# Altium schematic sheet Schematic_LED_SHIELD_DIGITAL.SchDoc: Digital Electronics
size B; Author: Artem Dementyev; DrawnBy: Artem Dementyev; Engineer: Artem Dementyev; Revision: 1
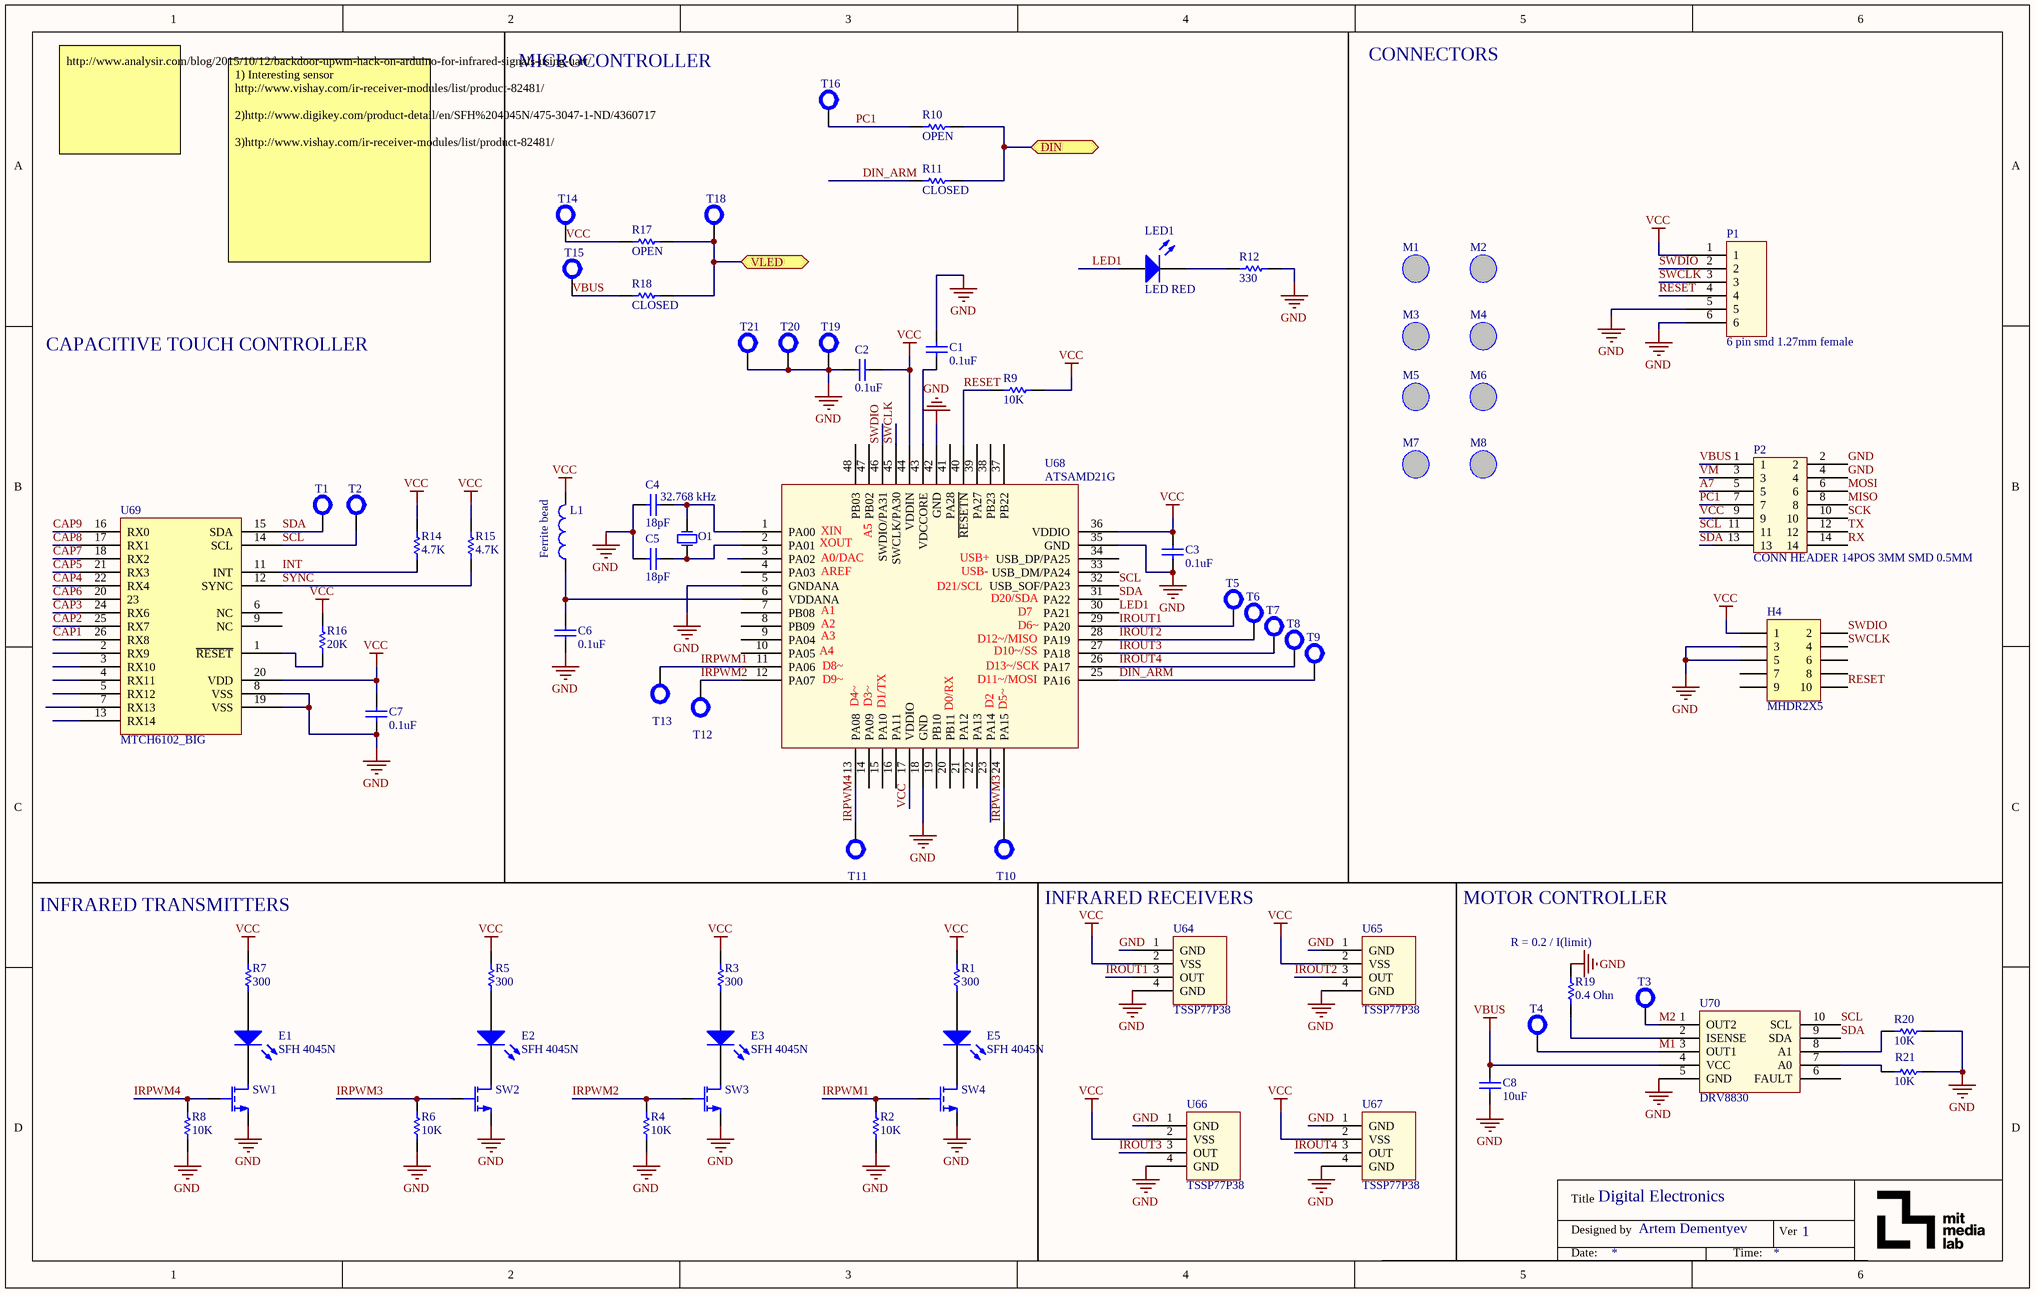
[diagram p0: Schematic_LED_SHIELD_DIGITAL.SchDoc]

## Parts
C1  0.1uF  [0603W]
C2  0.1uF  [0603W]
C3  0.1uF  [0603W]
C4  18pF  [0603W]
C5  18pF  [0603W]
C6  0.1uF  [0603W]
C7  0.1uF  [0603W]
C8  10uF  [0603W]
E1  SFH 4045N  [SFH 4045N]
E2  SFH 4045N  [SFH 4045N]
E3  SFH 4045N  [SFH 4045N]
E5  SFH 4045N  [SFH 4045N]
H4  MHDR2X5  [MHDR2X5]
L1  Ferrite bead  [0603W]
LED1  LED RED  [0603W]
M1  Custom_magnet_holder  [3mm_magnet_holder]  (value not drawn)
M2  Custom_magnet_holder  [3mm_magnet_holder]  (value not drawn)
M3  Custom_magnet_holder  [3mm_magnet_holder]  (value not drawn)
M4  Custom_magnet_holder  [3mm_magnet_holder]  (value not drawn)
M5  Custom_magnet_holder  [3mm_magnet_holder]  (value not drawn)
M6  Custom_magnet_holder  [3mm_magnet_holder]  (value not drawn)
M7  Custom_magnet_holder  [3mm_magnet_holder]  (value not drawn)
M8  Custom_magnet_holder  [3mm_magnet_holder]  (value not drawn)
O1  32.768 kHz  [32.768 Crystal]
P1  6 pin smd 1.27mm female  [6pos 1.27mm]
P2  CONN HEADER 14POS 3MM SMD 0.5MM  [DF12 14Pos Female]
R1  300  [0603W]
R2  10K  [0603W]
R3  300  [0603W]
R4  10K  [0603W]
R5  300  [0603W]
R6  10K  [0603W]
R7  300  [0603W]
R8  10K  [0603W]
R9  10K  [0603W]
R10  OPEN  [0603W]
R11  CLOSED  [0603W]
R12  330  [0603W]
R14  4.7K  [0603W]
R15  4.7K  [0603W]
R16  20K  [0603W]
R17  OPEN  [0603W]
R18  CLOSED  [0603W]
R19  0.4 Ohn  [0603W]
R20  10K  [0603W]
R21  10K  [0603W]
SW1  MOSFET N CHANNEL  [SOT323]  (value not drawn)
SW2  MOSFET N CHANNEL  [SOT323]  (value not drawn)
SW3  MOSFET N CHANNEL  [SOT323]  (value not drawn)
SW4  MOSFET N CHANNEL  [SOT323]  (value not drawn)
T1  Test point small  [TEST POINT SMD SUPER SMALL]  (value not drawn)
T2  Test point small  [TEST POINT SMD SUPER SMALL]  (value not drawn)
T3  Test point small  [TEST POINT SMD SUPER SMALL]  (value not drawn)
T4  Test point small  [TEST POINT SMD SUPER SMALL]  (value not drawn)
T5  Test point small  [TEST POINT SMD SUPER SMALL]  (value not drawn)
T6  Test point small  [TEST POINT SMD SUPER SMALL]  (value not drawn)
T7  Test point small  [TEST POINT SMD SUPER SMALL]  (value not drawn)
T8  Test point small  [TEST POINT SMD SUPER SMALL]  (value not drawn)
T9  Test point small  [TEST POINT SMD SUPER SMALL]  (value not drawn)
T10  Test point small  [TEST POINT SMD SUPER SMALL]  (value not drawn)
T11  Test point small  [TEST POINT SMD SUPER SMALL]  (value not drawn)
T12  Test point small  [TEST POINT SMD SUPER SMALL]  (value not drawn)
T13  Test point small  [TEST POINT SMD SUPER SMALL]  (value not drawn)
T14  Test point small  [TEST POINT SMD SUPER SMALL]  (value not drawn)
T15  Test point small  [TEST POINT SMD SUPER SMALL]  (value not drawn)
T16  Test point small  [TEST POINT SMD SUPER SMALL]  (value not drawn)
T18  Test point small  [TEST POINT SMD SUPER SMALL]  (value not drawn)
T19  Test point small  [TEST POINT SMD SUPER SMALL]  (value not drawn)
T20  Test point small  [TEST POINT SMD SUPER SMALL]  (value not drawn)
T21  Test point small  [TEST POINT SMD SUPER SMALL]  (value not drawn)
U64  TSSP77P38  [TSSP77P38]
U65  TSSP77P38  [TSSP77P38]
U66  TSSP77P38  [TSSP77P38]
U67  TSSP77P38  [TSSP77P38]
U68  ATSAMD21G  [TQFN48]
U69  MTCH6102_BIG  [SS28]
U70  DRV8830  [MSOP10_TI_POWERPAD]

## Ports
DIN, VLED

## Nets
GND: C1.2 C2.2 C3.1 C4.2 C5.2 C6.1 C7.1 C8.1 H4.3 H4.5 P1.5 P1.6 P2.2 P2.4 R2.2 R4.2 R6.2 R8.2 R12.1 R19.1 R20.2 R21.2 SW1.2(S) SW2.2(S) SW3.2(S) SW4.2(S) T19.0 T20.0 T21.0 U64.1(GND) U64.4(GND) U65.1(GND) U65.4(GND) U66.1(GND) U66.4(GND) U67.1(GND) U67.4(GND) U68.5(GNDANA) U68.18(GND) U68.35(GND) U68.42(GND) U69.8(VSS) U69.19(VSS) U70.5(GND)
VBUS: C8.2 P2.1 R18.2 T15.0 U70.4(VCC)
VCC: C2.1 C3.2 C7.2 H4.1 L1.2 P1.1 P2.9 R1.1 R3.1 R5.1 R7.1 R9.1 R14.2 R15.2 R16.1 R17.2 T14.0 U64.2(VSS) U65.2(VSS) U66.2(VSS) U67.2(VSS) U68.17(VDDIO) U68.36(VDDIO) U68.44(VDDIN) U69.20(VDD)
A7: P2.5
CAP1: U69.26(RX8)
CAP2: U69.25(RX7)
CAP3: U69.24(RX6)
CAP4: U69.22(RX4)
CAP5: U69.21(RX3)
CAP6: U69.20(23)
CAP7: U69.18(RX2)
CAP8: U69.17(RX1)
CAP9: U69.16(RX0)
DIN: R10.1 R11.1 ; port DIN
DIN_ARM: R11.2 T9.0 U68.25(PA16)
INT: R14.1 U69.11(INT)
IROUT1: T5.0 U64.3(OUT) U68.29(PA20)
IROUT2: T6.0 U65.3(OUT) U68.28(PA19)
IROUT3: T7.0 U66.3(OUT) U68.27(PA18)
IROUT4: T8.0 U67.3(OUT) U68.26(PA17)
IRPWM1: R2.1 SW4.1(G) T13.0 U68.11(PA06)
IRPWM2: R4.1 SW3.1(G) T12.0 U68.12(PA07)
IRPWM3: R6.1 SW2.1(G) T10.0 U68.24(PA15)
IRPWM4: R8.1 SW1.1(G) T11.0 U68.13(PA08)
LED1: LED1.1(A) U68.30(PA21)
M1: T4.0 U70.3(OUT1)
M2: T3.0 U70.1(OUT2)
MISO: P2.8
MOSI: P2.6
PC1: P2.7 R10.2 T16.0
RESET: H4.10 P1.4 R9.2 U68.40(~{RESETN})
RX: P2.14
SCK: P2.10
SCL: P2.11 T2.0 U68.32(USB_SOF/PA23) U69.14(SCL) U70.10(SCL)
SDA: P2.13 T1.0 U68.31(PA22) U69.15(SDA) U70.9(SDA)
SWCLK: H4.4 P1.3 U68.45(SWCLK/PA30)
SWDIO: H4.2 P1.2 U68.46(SWDIO/PA31)
SYNC: R15.1 U69.12(SYNC)
TX: P2.12
VLED: R17.1 R18.1 T18.0 ; port VLED
VM: P2.3
NetC1_1: C1.1 U68.43(VDCCORE)
NetC4_1: C4.1 O1.1 U68.1(PA00)
NetC5_1: C5.1 O1.2 U68.2(PA01)
NetC6_2: C6.2 L1.1 U68.6(VDDANA)
NetE1_1: E1.1(Cathode) SW1.3(D)
NetE1_2: E1.2(Anode) R7.2
NetE2_1: E2.1(Cathode) SW2.3(D)
NetE2_2: E2.2(Anode) R5.2
NetE3_1: E3.1(Cathode) SW3.3(D)
NetE3_2: E3.2(Anode) R3.2
NetE5_1: E5.1(Cathode) SW4.3(D)
NetE5_2: E5.2(Anode) R1.2
NetLED1_2: LED1.2(K) R12.2
NetR16_2: R16.2 U69.1(~{RESET})
NetR19_2: R19.2 U70.2(ISENSE)
NetR20_1: R20.1 U70.8(A1)
NetR21_1: R21.1 U70.7(A0)

Not connected (* = marked no-connect by the designer): H4 6 7 8 9; U68 3(PA02) 4(PA03) 7(PB08) 8(PB09) 9(PA04) 10(PA05) 14(PA09) 15(PA10) 16(PA11) 19(PB10) 20(PB11) 21(PA12) 22(PA13) 23(PA14) 33(USB_DM/PA24) 34(USB_DP/PA25) 37(PB22) 38(PB23) 39(PA27) 41(PA28) 47(PB02) 48(PB03); U69 2(RX9) 3(RX10) 4(RX11) 5(RX12) 6(NC) 7(RX13) 9(NC) 13(RX14); U70 6(FAULT)

## Notes on the sheet
- MICROCONTROLLER
- CONNECTORS
- http://www.analysir.com/blog/2015/10/12/backdoor-upwm-hack-on-arduino-for-infrared-signals-using-uart/
- 1) Interesting sensor http://www.vishay.com/ir-receiver-modules/list/product-82481/
  2)http://www.digikey.com/product-detail/en/SFH%204045N/475-3047-1-ND/4360717
  3)http://www.vishay.com/ir-receiver-modules/list/product-82481/
- CAPACITIVE TOUCH CONTROLLER
- (near R7) INFRARED TRANSMITTERS
- INFRARED RECEIVERS
- MOTOR CONTROLLER
- (near R19) R = 0.2 / I(limit)
- Title
- Designed by
- Ver
- Date:
- Time:
- (in symbol ATSAMD21G) XIN; A5; XOUT; A0/DAC; USB+; AREF; USB-; D21/SCL; D20/SDA; A1; D7; A2; D6~; A3; D12~/MISO; A4; D10~/SS; D8~; D13~/SCK; D9~; D11~/MOSI; D4~; D3~; D1/TX; D2; D5~; D0/RX

## Library data of the parts
C1-C8 = Capacitor: SMD Cap 1206
  C7: digikey number: 1276-1443-1-ND
E1-E3 E5 = SFH 4045N: High Power Infrared Emitter (940 nm); digikey part number: 475-3047-1-ND
H4 = MHDR2X5: Header, 5-Pin, Dual row; LatestRevisionDate: 17-Jul-2002; LatestRevisionNote: Re-released for DXP Platform.; Publisher: Altium Limited
L1 = INDUCTOR Low DCR: Digikey: 490-5223-2-ND
LED1 = LED: LED SMD 1206/0603; Sparkfun green: PRT-12622; Sparkfun blue: PRT-12620
O1 = 32.768 Crystal: digikey number: XC1617CT-ND
R1-R12 R14-R21 = Resistor
  R12: digikey number: RMCF0603FT10K0CT-ND
  R14 R15: digikey number: 311-4.7KJRCT-ND
  R16: digikey number: P20.0KLCT-ND
U64-U67 = TSSP77P38: IR Detector for Mid Range Proximity Sensor; digikey part number: TSSP77P38TCT-ND
U68 = ATSAMD21G: IC MCU 32BIT 256KB FLASH 48TQFP; digikey part number: ATSAMD21G18A-AUTCT-ND
U70 = DRV8830: Low-Voltage Motor Driver With Serial Interface; digikey part number: 296-28165-1-ND
P1 = 6 pin smd 1.27mm female: digikey: S9005E-06-ND
P2 = CONN HEADER 14POS 3MM SMD 0.5MM: digikey part number: H11701TR-ND; digikey part number female: H11701TR-ND
SW1-SW4 = MOSFET N CHANNEL: digikey part number: 568-5987-1-ND
T1-T16 T18-T21 = Test point small: digikey number: 5000K-ND